# Altium schematic sheet JHZ-E01S-HW-Sensor-H-I-S0.1.SchDoc
size A4
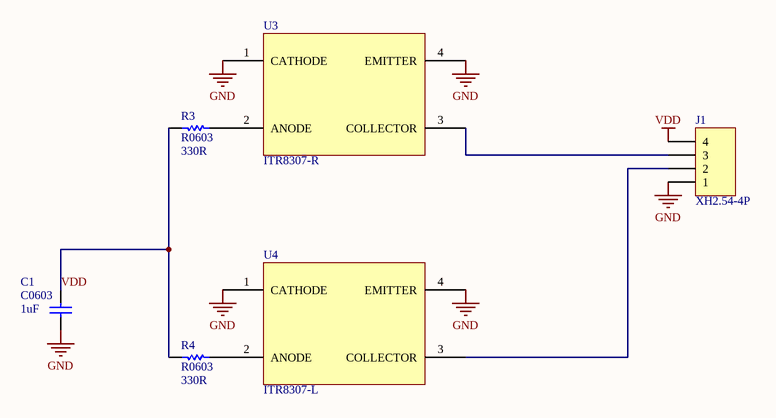
[diagram p0: JHZ-E01S-HW-Sensor-H-I-S0.1.SchDoc]

## Parts
C1  C0603  value 1uF  [C0603_M1608]
J1  value XH2.54-4P  [PH-AWB-4P]  (hidden comment: PH-AWB-4P)
R3  R0603  value 330R  [R0603_M1608]
R4  R0603  value 330R  [R0603_M1608]
U3  ITR8307-R  [ITR8307]
U4  ITR8307-L  [ITR8307]

## Nets
GND: C1.2 J1.1 U3.1(CATHODE) U3.4(EMITTER) U4.1(CATHODE) U4.4(EMITTER)
VDD: C1.1 J1.4 R3.2 R4.2
NetJ1_2: J1.2 U4.3(COLLECTOR)
NetJ1_3: J1.3 U3.3(COLLECTOR)
NetR3_1: R3.1 U3.2(ANODE)
NetR4_1: R4.1 U4.2(ANODE)

## Library data of the parts
C1 = Cap: Capacitor; Published: 8-Jun-2000; LatestRevisionDate: 17-Jul-2002; LatestRevisionNote: Re-released for DXP Platform.; PackageReference: RAD-0.3; Publisher: Altium Limited; PackageDescription: Radial Cap, Thru-Hole; 2 Leads; 0.3 in Pin Spacing
J1 = XH2.54-4P: 插座XH2.54-4P; LatestRevisionDate: 17-Jul-2002; LatestRevisionNote: Re-released for DXP Platform.; Publisher: Altium Limited
R3 R4 = Res1: Resistor; Published: 8-Jun-2000; LatestRevisionDate: 17-Jul-2002; LatestRevisionNote: Re-released for DXP Platform.; PackageReference: AXIAL-0.3; Publisher: Altium Limited
U3 U4 = Component_1